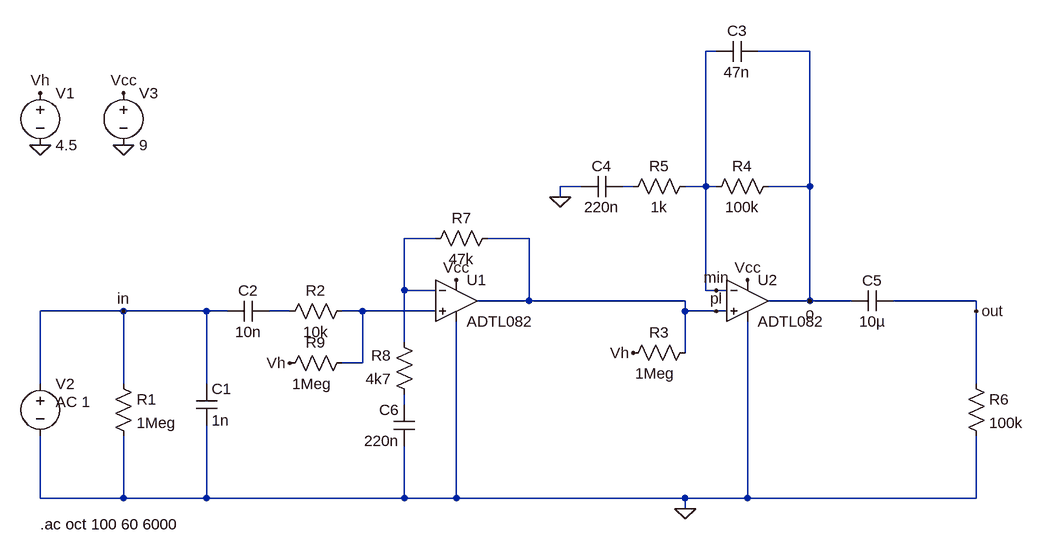
[diagram p0: schematic lowmod_prestage.asc]
lowmod_prestage.asc, the LTspice schematic file:
Version 4
SHEET 1 892 680
WIRE 272 -528 256 -528
WIRE 416 -528 336 -528
WIRE 64 -320 32 -320
WIRE 144 -320 128 -320
WIRE 256 -320 256 -528
WIRE 256 -320 224 -320
WIRE 272 -320 256 -320
WIRE 416 -320 416 -528
WIRE 416 -320 352 -320
WIRE 32 -304 32 -320
WIRE -160 -240 -208 -240
WIRE -16 -240 -80 -240
WIRE -208 -160 -208 -240
WIRE -160 -160 -208 -160
WIRE 256 -160 256 -320
WIRE 272 -160 256 -160
WIRE 288 -160 272 -160
WIRE -16 -144 -16 -240
WIRE -16 -144 -96 -144
WIRE 224 -144 -16 -144
WIRE 416 -144 416 -320
WIRE 416 -144 352 -144
WIRE 480 -144 416 -144
WIRE 672 -144 544 -144
WIRE -640 -128 -768 -128
WIRE -512 -128 -640 -128
WIRE -480 -128 -512 -128
WIRE -384 -128 -416 -128
WIRE -272 -128 -304 -128
WIRE -160 -128 -272 -128
WIRE 224 -128 224 -144
WIRE 272 -128 224 -128
WIRE 288 -128 272 -128
WIRE 672 -128 672 -144
WIRE -208 -80 -208 -160
WIRE 224 -64 224 -128
WIRE -272 -48 -272 -128
WIRE -272 -48 -304 -48
WIRE -768 -16 -768 -128
WIRE -640 -16 -640 -128
WIRE -512 -16 -512 -128
WIRE 672 -16 672 -128
WIRE -208 16 -208 0
WIRE -768 160 -768 64
WIRE -640 160 -640 64
WIRE -640 160 -768 160
WIRE -512 160 -512 48
WIRE -512 160 -640 160
WIRE -208 160 -208 80
WIRE -208 160 -512 160
WIRE -128 160 -128 -112
WIRE -128 160 -208 160
WIRE 224 160 -128 160
WIRE 320 160 320 -112
WIRE 320 160 224 160
WIRE 672 160 672 64
WIRE 672 160 320 160
WIRE 224 176 224 160
FLAG 224 176 0
FLAG 32 -304 0
FLAG 416 -144 o
FLAG -640 -128 in
FLAG 672 -128 out
FLAG 272 -128 pl
FLAG 272 -160 min
FLAG -640 -464 Vcc
FLAG 320 -176 Vcc
FLAG -768 -464 Vh
FLAG 144 -64 Vh
FLAG -768 -384 0
FLAG -640 -384 0
FLAG -128 -176 Vcc
FLAG -384 -48 Vh
SYMBOL res -656 -32 R0
SYMATTR InstName R1
SYMATTR Value 1Meg
SYMBOL cap -528 -16 R0
SYMATTR InstName C1
SYMATTR Value 1n
SYMBOL res 240 -80 R90
WINDOW 0 0 56 VBottom 2
WINDOW 3 32 62 VTop 2
SYMATTR InstName R3
SYMATTR Value 1Meg
SYMBOL res -288 -144 R90
WINDOW 0 0 56 VBottom 2
WINDOW 3 32 56 VTop 2
SYMATTR InstName R2
SYMATTR Value 10k
SYMBOL cap -416 -144 R90
WINDOW 0 0 32 VBottom 2
WINDOW 3 32 32 VTop 2
SYMATTR InstName C2
SYMATTR Value 10n
SYMBOL res 368 -336 R90
WINDOW 0 0 56 VBottom 2
WINDOW 3 32 56 VTop 2
SYMATTR InstName R4
SYMATTR Value 100k
SYMBOL res 240 -336 R90
WINDOW 0 0 56 VBottom 2
WINDOW 3 32 56 VTop 2
SYMATTR InstName R5
SYMATTR Value 1k
SYMBOL cap 336 -544 R90
WINDOW 0 0 32 VBottom 2
WINDOW 3 32 32 VTop 2
SYMATTR InstName C3
SYMATTR Value 47n
SYMBOL cap 128 -336 R90
WINDOW 0 0 32 VBottom 2
WINDOW 3 32 32 VTop 2
SYMATTR InstName C4
SYMATTR Value 220n
SYMBOL voltage -768 -32 R0
WINDOW 3 24 44 Left 2
WINDOW 123 24 44 Left 2
WINDOW 39 0 0 Left 0
SYMATTR Value ""
SYMATTR Value2 AC 1
SYMATTR InstName V2
SYMBOL voltage -640 -480 R0
WINDOW 123 0 0 Left 0
WINDOW 39 0 0 Left 0
SYMATTR InstName V3
SYMATTR Value 9
SYMBOL cap 544 -160 R90
WINDOW 0 0 32 VBottom 2
WINDOW 3 32 32 VTop 2
SYMATTR InstName C5
SYMATTR Value 10µ
SYMBOL res 656 -32 R0
SYMATTR InstName R6
SYMATTR Value 100k
SYMBOL voltage -768 -480 R0
WINDOW 123 0 0 Left 0
WINDOW 39 0 0 Left 0
SYMATTR InstName V1
SYMATTR Value 4.5
SYMBOL res -64 -256 R90
WINDOW 0 0 56 VBottom 2
WINDOW 3 32 56 VTop 2
SYMATTR InstName R7
SYMATTR Value 47k
SYMBOL res -192 16 R180
WINDOW 0 36 76 Left 2
WINDOW 3 36 40 Left 2
SYMATTR InstName R8
SYMATTR Value 4k7
SYMBOL OpAmps\\ADTL082 -128 -208 R0
SYMATTR InstName U1
SYMBOL OpAmps\\ADTL082 320 -208 R0
SYMATTR InstName U2
SYMBOL res -288 -64 R90
WINDOW 0 0 56 VBottom 2
WINDOW 3 32 62 VTop 2
SYMATTR InstName R9
SYMATTR Value 1Meg
SYMBOL cap -192 80 R180
WINDOW 0 24 56 Left 2
WINDOW 3 24 8 Left 2
SYMATTR InstName C6
SYMATTR Value 220n
TEXT -768 200 Left 2 !.ac oct 100 60 6000

The netlist it stands for:
* lowmod_prestage.asc
R1 in 0 1Meg
C1 in 0 1n
R3 pl Vh 1Meg
R2 N004 N003 10k
C2 N003 in 10n
R4 o min 100k
R5 min N001 1k
C3 o min 47n
C4 N001 0 220n
V2 in 0 AC 1
V3 Vcc 0 9
C5 out o 10µ
R6 out 0 100k
V1 Vh 0 4.5
R7 pl N002 47k
R8 N005 N002 4k7
XU1 N004 N002 Vcc 0 pl ADTL082  ; pins In+ In- V+ V- OUT
XU2 pl min Vcc 0 o ADTL082  ; pins In+ In- V+ V- OUT
R9 N004 Vh 1Meg
C6 0 N005 220n
.ac oct 100 60 6000
.lib ADI.lib
.backanno
.end